# EAGLE design implant 5.3 (EAGLE 8.4.2)
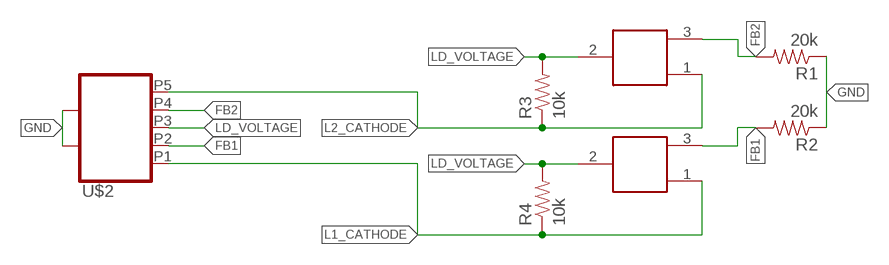
[diagram p0: schematic, sheet 1]

## Parts
R1  20k  RESISTOR0805-RES  [0805]
R2  20k  RESISTOR0805-RES  [0805]
R3  10k  RESISTOR0805-RES  [0805]
R4  10k  RESISTOR0805-RES  [0805]
U$2  USB_MICRO_SOCKET_VERT  [USB_VERT_MICRO_SMD]
U$6  LASERDIODE5.6MM  [LASERDIODE_5.6]
U$7  LASERDIODE5.6MM  [LASERDIODE_5.6]

## Nets
FB1: R2.2 U$2.P2 U$6.3
FB2: R1.2 U$2.P4 U$7.3
GND: R1.1 R2.1 U$2.P$1 U$2.P$2 U$2.P$3
L1_CATHODE: R4.1 U$2.P1 U$6.1
L2_CATHODE: R3.1 U$2.P5 U$7.1
LD_VOLTAGE: R3.2 R4.2 U$2.P3 U$6.2 U$7.2

## Library data of the parts
R1-R4 = Andy-library:RESISTOR: Resistor Basic schematic elements and footprints for 0603, 1206, and PTH resistors.
U$2 = Cerebro-library:USB_MICRO_SOCKET: horizontal socket. Digikey 609-4616-1-ND
U$6 U$7 = Andy-library:LASERDIODE

## Board
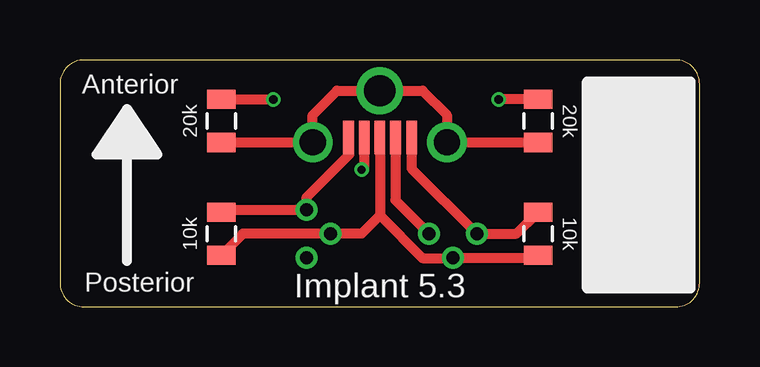
[diagram p1: board, top side]
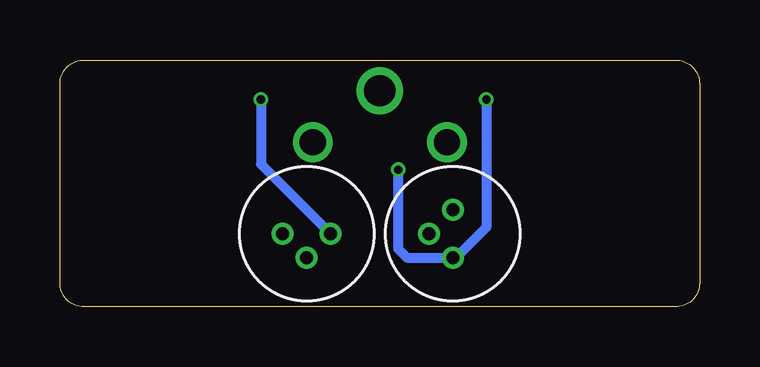
[diagram p2: board, bottom side, seen from below]

Size 26.67 x 10.29 mm. Coordinates in mm from the lower left corner, seen from the top.
Outline: 0,9.29 0,1 arc90 1,0 25.67,0 arc90 26.67,1 26.67,9.29 arc90 25.67,10.29 1,10.29 arc90 0,9.29
Copper layers (1*16): Top 0.035559375mm / dielectric 1.6mm / Bottom 0.035559375mm
Design rules "oshpark-2layer *": minimum track width 6mil, minimum drill 10mil, track to track 6mil, track to pad 6mil, pad to pad 6mil, via to via 6mil, smd to smd 6mil, copper to edge 15mil, drill to drill 6mil, minimum pad ring 5mil, minimum via ring 5mil, stop-mask expansion 2.5mil, vias tented up to drill 0.35mm, thermal gap 10mil

### Footprints (pad centres in the part's own frame; a part is rotated, then mirrored left to right if it is on the bottom)
0805 = smd 0.8 x 1.2: 1 -0.9,0; 2 0.9,0
USB_VERT_MICRO_SMD = smd 0.45 x 1.4: P1 -1.33,-0.2; P2 -0.65,-0.2; P3 0,-0.2; P4 0.65,-0.2; P5 1.3,-0.2 | drill 1.1: P$1 -2.8,0; P$2 2.8,0 | drill 1.3: P$3 0,-2.15
LASERDIODE_5.6 = drill 0.55 pad 0.914: 1 -1,0; 2 0,-1; 3 1,0

### Placement (x,y rotation side)
R1  6.73,7.75 90 top
R2  19.94,7.75 90 top
R3  6.73,3.05 270 top
R4  19.94,3.05 270 top
U$2  13.34,6.86 180 top
U$6  16.38,3.05 0 bottom
U$7  10.29,3.05 270 bottom

### Tracks (layer width: path | path; a pad name or v marks a point on that pad's centre or on a via)
FB1  (via drill 0.35)
  Top 0.406: R2.2 v18.3,8.65 v18.29,8.64 | U$2.P2 13.98,4.45 U$6.3
  Bottom 0.406: v18.29,8.64 18.29,5.95 U$6.3
FB2  (via drill 0.35)
  Top 0.406: U$2.P4 12.69,5.83 v12.57,5.71 | R1.2 8.88,8.65 v8.89,8.64
  Bottom 0.406: v12.57,5.71 12.57,2.41 12.21,2.05 U$7.3 10.16,2.05 8.89,3.32 v8.89,8.64
GND
  Top 0.406: R1.1 10.52,6.85 U$2.P$2 10.54,8 11.55,9.01 U$2.P$3 15.12,9.01 16.13,8 U$2.P$1 19.93,6.86 R2.1
L1_CATHODE
  Top 0.406: U$2.P1 14.66,5.77 U$6.1 19.04,3.05 R4.1
L2_CATHODE
  Top 0.406: R3.1 6.83,4.05 U$7.1 10.29,4.57 12.06,6.35 12.04,6.35 U$2.P5
LD_VOLTAGE
  Top 0.406: U$2.P3 13.34,3.81 | 13.34,3.81 12.57,3.05 U$7.2 7.63,3.05 R3.2 | 13.34,3.81 15.11,2.03 16.37,2.03 U$6.2 19.84,2.05 R4.2

### Text on the board
tNames: Anterior | Posterior | Implant 5.3